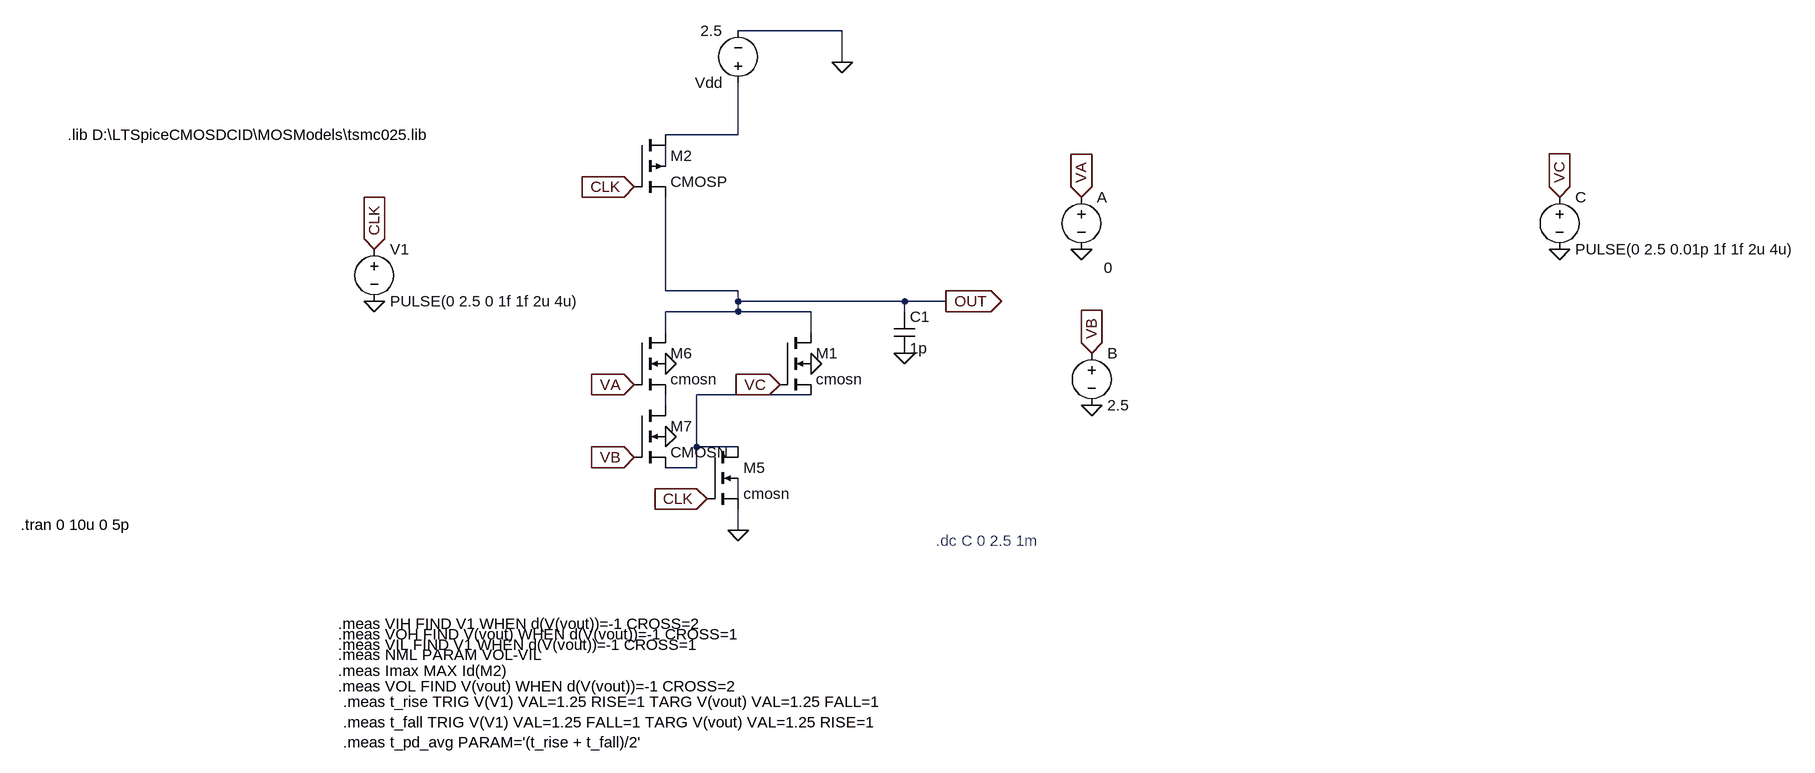
[diagram p0: schematic dynamic_1.asc]
dynamic_1.asc, the LTspice schematic file:
Version 4
SHEET 1 2760 680
WIRE 1184 -512 1024 -512
WIRE 1184 -464 1184 -512
WIRE 1024 -352 1024 -432
WIRE 1024 -352 912 -352
WIRE 912 -304 912 -336
WIRE 912 -112 912 -256
WIRE 1024 -112 912 -112
WIRE 1024 -96 1024 -112
WIRE 1280 -96 1024 -96
WIRE 1344 -96 1280 -96
WIRE 1024 -80 1024 -96
WIRE 1024 -80 912 -80
WIRE 1136 -80 1024 -80
WIRE 1280 -80 1280 -96
WIRE 912 -48 912 -80
WIRE 1136 -48 1136 -80
WIRE 1136 48 960 48
WIRE 912 64 912 48
WIRE 960 128 960 48
WIRE 1024 128 960 128
WIRE 960 160 960 128
WIRE 960 160 912 160
WIRE 1024 208 1024 176
WIRE 1024 256 1024 224
FLAG 1024 256 0
FLAG 1184 -464 0
FLAG 912 0 0
FLAG 1136 0 0
FLAG 1552 -256 VA
IOPIN 1552 -256 In
FLAG 2288 -256 VC
IOPIN 2288 -256 In
FLAG 1552 -176 0
FLAG 2288 -176 0
FLAG 864 32 VA
IOPIN 864 32 In
FLAG 1088 32 VC
IOPIN 1088 32 In
FLAG 864 144 VB
IOPIN 864 144 In
FLAG 976 208 CLK
IOPIN 976 208 In
FLAG 864 -272 CLK
IOPIN 864 -272 In
FLAG 912 112 0
FLAG 464 -96 0
FLAG 464 -176 CLK
IOPIN 464 -176 In
FLAG 1344 -96 OUT
IOPIN 1344 -96 Out
FLAG 1568 64 0
FLAG 1568 -16 VB
IOPIN 1568 -16 In
FLAG 1280 -16 0
SYMBOL nmos4 1088 -48 R0
SYMATTR InstName M1
SYMATTR Value cmosn
SYMATTR Value2 l=250n w=360n ad=0.1728p as=0.1728p pd=1680n ps=1680n
SYMBOL voltage 1024 -416 R180
WINDOW 123 0 0 Left 0
WINDOW 39 0 0 Left 0
SYMATTR InstName Vdd
SYMATTR Value 2.5
SYMBOL nmos4 976 128 R0
SYMATTR InstName M5
SYMATTR Value cmosn
SYMATTR Value2 l=250n w=360n ad=0.1728p as=0.1728p pd=1680n ps=1680n
SYMBOL nmos4 864 -48 R0
SYMATTR InstName M6
SYMATTR Value cmosn
SYMATTR Value2 l=250n w=360n ad=0.1728p as=0.1728p pd=1680n ps=1680n
SYMBOL voltage 1552 -272 R0
WINDOW 3 35 124 Left 2
WINDOW 123 0 0 Left 0
WINDOW 39 35 152 Left 2
SYMATTR Value 0
SYMATTR InstName A
SYMBOL voltage 2288 -272 R0
WINDOW 123 0 0 Left 0
WINDOW 39 0 0 Left 0
SYMATTR InstName C
SYMATTR Value PULSE(0 2.5 0.01p 1f 1f 2u 4u)
SYMBOL cmosn 864 64 R0
SYMATTR InstName M7
SYMBOL voltage 464 -192 R0
WINDOW 123 0 0 Left 0
WINDOW 39 0 0 Left 0
SYMATTR InstName V1
SYMATTR Value PULSE(0 2.5 0 1f 1f 2u 4u)
SYMBOL cmosp 864 -352 R0
SYMATTR InstName M2
SYMBOL voltage 1568 -32 R0
WINDOW 123 0 0 Left 0
WINDOW 39 24 124 Left 2
SYMATTR InstName B
SYMATTR Value 2.5
SYMBOL cap 1264 -80 R0
SYMATTR InstName C1
SYMATTR Value 1p
TEXT -8 -352 Left 2 !.lib D:\\LTSpiceCMOSDCID\\MOSModels\\tsmc025.lib
TEXT 408 496 Left 2 !.meas VOL FIND V(vout) WHEN d(V(vout))=-1 CROSS=2
TEXT 408 400 Left 2 !.meas VIH FIND V1 WHEN d(V(vout))=-1 CROSS=2
TEXT 408 416 Left 2 !.meas VOH FIND V(vout) WHEN d(V(vout))=-1 CROSS=1
TEXT 408 432 Left 2 !.meas VIL FIND V1 WHEN d(V(vout))=-1 CROSS=1
TEXT 408 448 Left 2 !.meas NML PARAM VOL-VIL
TEXT 408 472 Left 2 !.meas Imax MAX Id(M2)
TEXT 416 520 Left 2 !.meas t_rise TRIG V(V1) VAL=1.25 RISE=1 TARG V(vout) VAL=1.25 FALL=1\n.meas t_fall TRIG V(V1) VAL=1.25 FALL=1 TARG V(vout) VAL=1.25 RISE=1\n.meas t_pd_avg PARAM='(t_rise + t_fall)/2'
TEXT -80 248 Left 2 !.tran 0 10u 0 5p
TEXT 1328 272 Left 2 ;.dc C 0 2.5 1m

The netlist it stands for:
* dynamic_1.asc
M1 OUT VC N003 0 cmosn l=250n w=360n ad=0.1728p as=0.1728p pd=1680n ps=1680n
Vdd N001 0 2.5
M5 N003 CLK 0 N005 cmosn l=250n w=360n ad=0.1728p as=0.1728p pd=1680n ps=1680n
M6 OUT VA N004 0 cmosn l=250n w=360n ad=0.1728p as=0.1728p pd=1680n ps=1680n
V§A VA 0 0
V§C VC 0 PULSE(0 2.5 0.01p 1f 1f 2u 4u)
M7 N004 VB N003 0 CMOSN
V1 CLK 0 PULSE(0 2.5 0 1f 1f 2u 4u)
M2 N001 CLK OUT N002 CMOSP
V§B VB 0 2.5
C1 OUT 0 1p
.model NMOS NMOS
.model PMOS PMOS
.lib standard.mos
.lib D:\LTSpiceCMOSDCID\MOSModels\tsmc025.lib
.meas VOL FIND V(vout) WHEN d(V(vout))=-1 CROSS=2
.meas VIH FIND V1 WHEN d(V(vout))=-1 CROSS=2
.meas VOH FIND V(vout) WHEN d(V(vout))=-1 CROSS=1
.meas VIL FIND V1 WHEN d(V(vout))=-1 CROSS=1
.meas NML PARAM VOL-VIL
.meas Imax MAX Id(M2)
.meas t_rise TRIG V(V1) VAL=1.25 RISE=1 TARG V(vout) VAL=1.25 FALL=1
.meas t_fall TRIG V(V1) VAL=1.25 FALL=1 TARG V(vout) VAL=1.25 RISE=1
.meas t_pd_avg PARAM='(t_rise + t_fall)/2'
.tran 0 10u 0 5p
* .dc C 0 2.5 1m
.backanno
.end